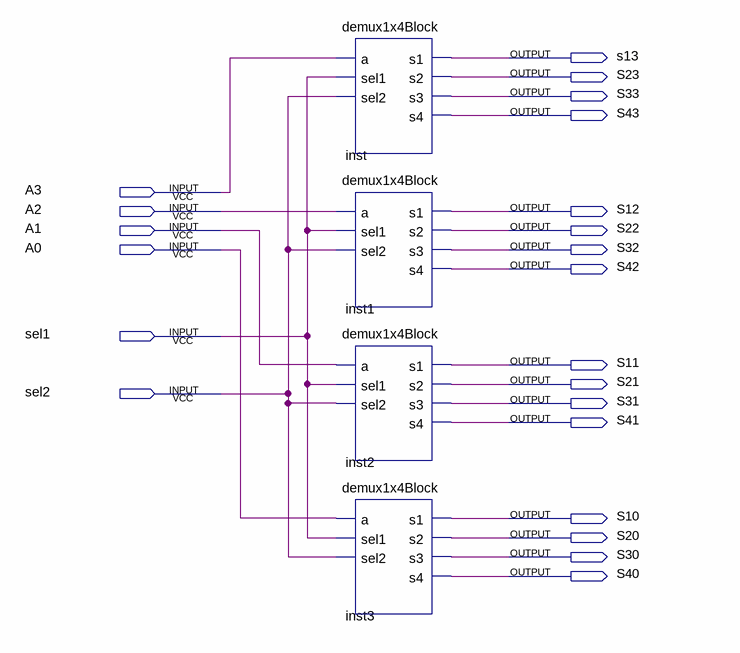
[diagram p0: schematic sheet]
// Quartus schematic demuxBlock.bdf as structural Verilog: 4 symbols, 22 pins
module demuxBlock (
  input  A3,
  input  A2,
  input  A1,
  input  A0,
  input  sel1,
  input  sel2,
  output s13,
  output S23,
  output S33,
  output S43,
  output S12,
  output S22,
  output S32,
  output S42,
  output S11,
  output S21,
  output S31,
  output S41,
  output S10,
  output S20,
  output S30,
  output S40
);

  demux1x4Block inst (.a(A3), .sel1(sel1), .sel2(sel2), .s1(s13), .s2(S23), .s3(S33), .s4(S43));
  demux1x4Block inst1 (.a(A2), .sel1(sel1), .sel2(sel2), .s1(S12), .s2(S22), .s3(S32), .s4(S42));
  demux1x4Block inst2 (.a(A1), .sel1(sel1), .sel2(sel2), .s1(S11), .s2(S21), .s3(S31), .s4(S41));
  demux1x4Block inst3 (.a(A0), .sel1(sel1), .sel2(sel2), .s1(S10), .s2(S20), .s3(S30), .s4(S40));
endmodule
